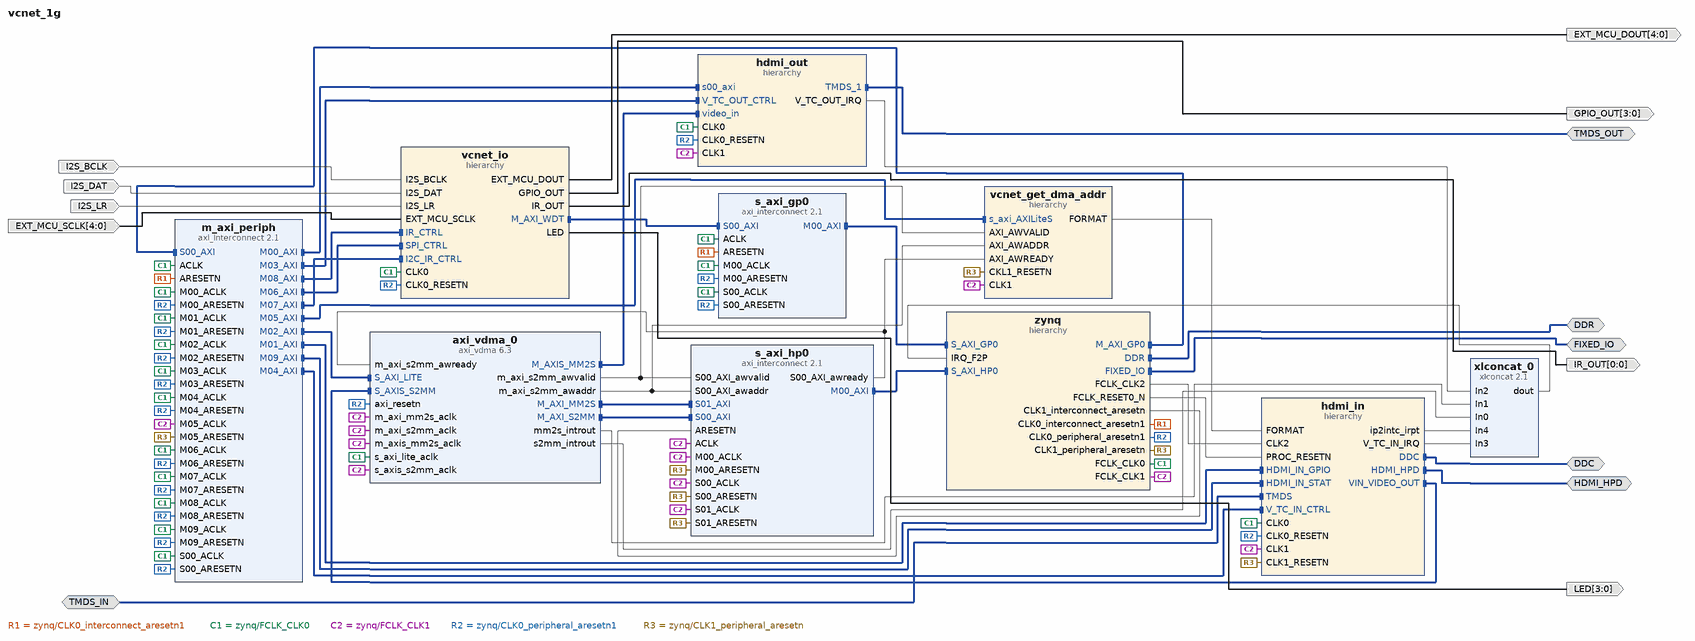
[diagram p0: block diagram of the top level]
# Vivado block design vcnet_1g, xc7z020clg400-1, Vivado 2021.2
create_bd_design vcnet_1g

create_bd_intf_port -mode Master -vlnv xilinx.com:interface:ddrx_rtl:1.0 DDR
create_bd_intf_port -mode Master -vlnv xilinx.com:display_processing_system7:fixedio_rtl:1.0 FIXED_IO
create_bd_intf_port -mode Master -vlnv xilinx.com:interface:gpio_rtl:1.0 HDMI_HPD
create_bd_intf_port -mode Slave -vlnv digilentinc.com:interface:tmds_rtl:1.0 TMDS_IN
create_bd_intf_port -mode Master -vlnv xilinx.com:interface:iic_rtl:1.0 DDC
create_bd_intf_port -mode Master -vlnv digilentinc.com:interface:tmds_rtl:1.0 TMDS_OUT
create_bd_port -dir O -from 0 -to 0 IR_OUT
create_bd_port -dir O -from 3 -to 0 LED
create_bd_port -dir I -from 4 -to 0 EXT_MCU_SCLK
create_bd_port -dir O -from 4 -to 0 EXT_MCU_DOUT
create_bd_port -dir I I2S_BCLK
create_bd_port -dir I I2S_LR
create_bd_port -dir I I2S_DAT
create_bd_port -dir O -from 3 -to 0 GPIO_OUT

create_bd_cell -type ip -vlnv xilinx.com:ip:axi_vdma:6.3 axi_vdma_0
set_property -dict [list \
  CONFIG.c_m_axi_mm2s_data_width 32 \
  CONFIG.c_m_axis_mm2s_tdata_width 24 \
  CONFIG.c_mm2s_genlock_mode 0 \
  CONFIG.c_mm2s_linebuffer_depth 4096 \
  CONFIG.c_mm2s_max_burst_length 32 \
  CONFIG.c_num_fstores 8 \
  CONFIG.c_s2mm_genlock_mode 0 \
  CONFIG.c_s2mm_linebuffer_depth 4096 \
  CONFIG.c_s2mm_max_burst_length 32 \
] [get_bd_cells axi_vdma_0]
create_bd_cell -type hier vcnet_get_dma_addr
create_bd_cell -type hier hdmi_out
create_bd_cell -type hier hdmi_in
create_bd_cell -type hier vcnet_io
create_bd_cell -type hier zynq
create_bd_cell -type ip -vlnv xilinx.com:ip:axi_interconnect:2.1 s_axi_hp0
set_property -dict [list \
  CONFIG.M00_HAS_DATA_FIFO 2 \
  CONFIG.M00_HAS_REGSLICE 4 \
  CONFIG.NUM_MI 1 \
  CONFIG.NUM_SI 2 \
  CONFIG.S00_HAS_DATA_FIFO 2 \
  CONFIG.S00_HAS_REGSLICE 4 \
  CONFIG.S01_HAS_DATA_FIFO 2 \
  CONFIG.S01_HAS_REGSLICE 4 \
] [get_bd_cells s_axi_hp0]
create_bd_cell -type ip -vlnv xilinx.com:ip:axi_interconnect:2.1 m_axi_periph
set_property -dict {CONFIG.NUM_MI 10} [get_bd_cells m_axi_periph]
create_bd_cell -type ip -vlnv xilinx.com:ip:axi_interconnect:2.1 s_axi_gp0
set_property -dict {CONFIG.NUM_MI 1} [get_bd_cells s_axi_gp0]
create_bd_cell -type ip -vlnv xilinx.com:ip:xlconcat:2.1 xlconcat_0
set_property -dict {CONFIG.NUM_PORTS 5 CONFIG.dout_width 5} [get_bd_cells xlconcat_0]

# ---- hierarchy /vcnet_get_dma_addr ----
current_bd_instance /vcnet_get_dma_addr
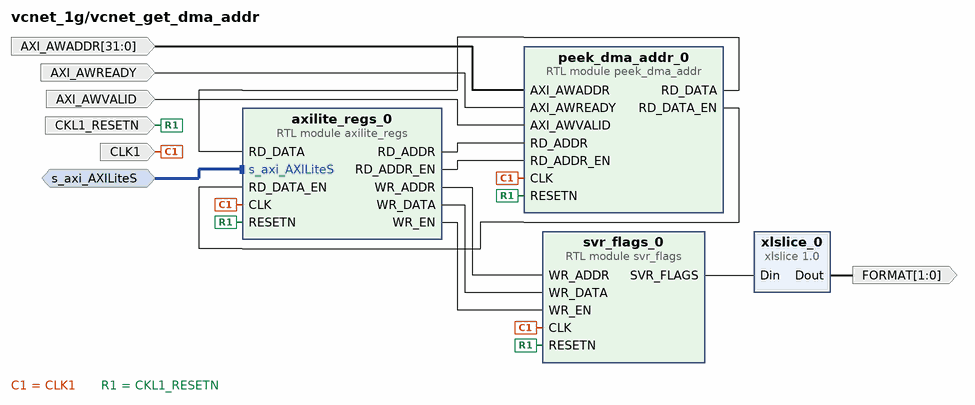
[diagram p1: block diagram inside /vcnet_get_dma_addr]
create_bd_intf_pin -mode Slave -vlnv xilinx.com:interface:aximm_rtl:1.0 s_axi_AXILiteS
create_bd_pin -dir I -type clk CLK1
create_bd_pin -dir I AXI_AWREADY
create_bd_pin -dir I AXI_AWVALID
create_bd_pin -dir I -from 31 -to 0 AXI_AWADDR
create_bd_pin -dir I -type rst CKL1_RESETN
create_bd_pin -dir O -from 1 -to 0 -type data FORMAT

create_bd_cell -type module -reference axilite_regs axilite_regs_0
create_bd_cell -type module -reference svr_flags svr_flags_0
create_bd_cell -type ip -vlnv xilinx.com:ip:xlslice:1.0 xlslice_0
set_property -dict {CONFIG.DIN_FROM 1 CONFIG.DIN_WIDTH 8 CONFIG.DOUT_WIDTH 2} [get_bd_cells xlslice_0]
create_bd_cell -type module -reference peek_dma_addr peek_dma_addr_0

# ---- hierarchy /hdmi_out ----
current_bd_instance /hdmi_out
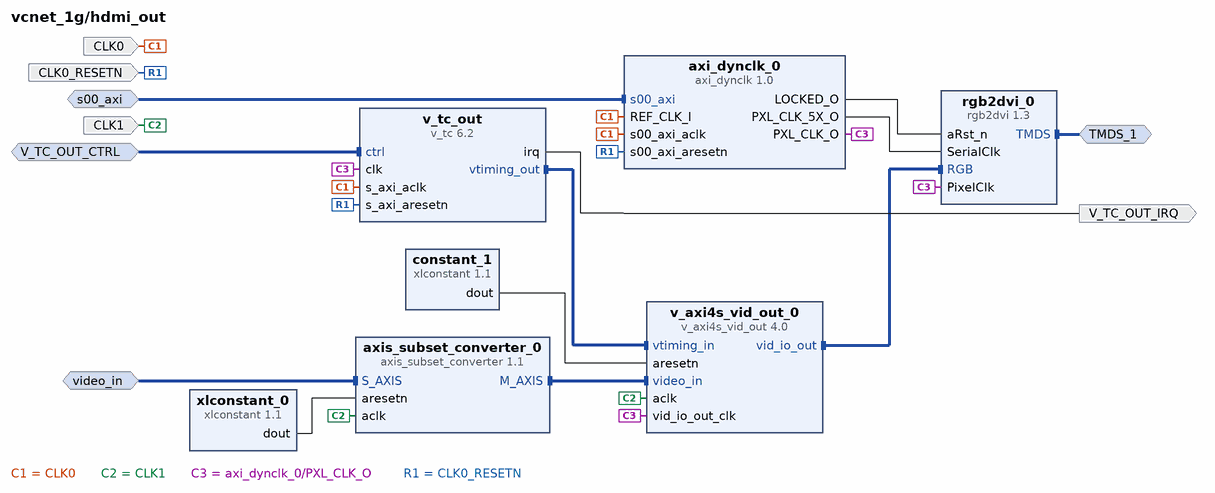
[diagram p2: block diagram inside /hdmi_out]
create_bd_intf_pin -mode Master -vlnv digilentinc.com:interface:tmds_rtl:1.0 TMDS_1
create_bd_intf_pin -mode Slave -vlnv xilinx.com:interface:aximm_rtl:1.0 V_TC_OUT_CTRL
create_bd_intf_pin -mode Slave -vlnv xilinx.com:interface:aximm_rtl:1.0 s00_axi
create_bd_intf_pin -mode Slave -vlnv xilinx.com:interface:axis_rtl:1.0 video_in
create_bd_pin -dir I -type clk CLK0
create_bd_pin -dir I -type clk CLK1
create_bd_pin -dir I -type rst CLK0_RESETN
create_bd_pin -dir O -type intr V_TC_OUT_IRQ

create_bd_cell -type ip -vlnv xilinx.com:ip:v_tc:6.2 v_tc_out
set_property -dict {CONFIG.enable_detection false} [get_bd_cells v_tc_out]
create_bd_cell -type ip -vlnv xilinx.com:ip:xlconstant:1.1 constant_1
create_bd_cell -type ip -vlnv digilentinc.com:ip:axi_dynclk:1.0 axi_dynclk_0
set_property -dict {CONFIG.ADD_BUFMR false} [get_bd_cells axi_dynclk_0]
create_bd_cell -type ip -vlnv xilinx.com:ip:v_axi4s_vid_out:4.0 v_axi4s_vid_out_0
set_property -dict [list \
  CONFIG.C_ADDR_WIDTH 12 \
  CONFIG.C_HAS_ASYNC_CLK 1 \
  CONFIG.C_S_AXIS_VIDEO_DATA_WIDTH 8 \
  CONFIG.C_S_AXIS_VIDEO_FORMAT 2 \
  CONFIG.C_VTG_MASTER_SLAVE 1 \
] [get_bd_cells v_axi4s_vid_out_0]
create_bd_cell -type ip -vlnv digilentinc.com:ip:rgb2dvi:1.3 rgb2dvi_0
set_property -dict {CONFIG.kClkRange 1 CONFIG.kGenerateSerialClk false CONFIG.kRstActiveHigh false} [get_bd_cells rgb2dvi_0]
create_bd_cell -type ip -vlnv xilinx.com:ip:axis_subset_converter:1.1 axis_subset_converter_0
set_property -dict [list \
  CONFIG.M_HAS_TKEEP 1 \
  CONFIG.M_HAS_TLAST 1 \
  CONFIG.M_HAS_TREADY 1 \
  CONFIG.M_HAS_TSTRB 0 \
  CONFIG.M_TDATA_NUM_BYTES 3 \
  CONFIG.M_TDEST_WIDTH 0 \
  CONFIG.M_TID_WIDTH 0 \
  CONFIG.M_TUSER_WIDTH 1 \
  CONFIG.S_HAS_TKEEP 1 \
  CONFIG.S_HAS_TLAST 1 \
  CONFIG.S_HAS_TREADY 1 \
  CONFIG.S_HAS_TSTRB 0 \
  CONFIG.S_TDATA_NUM_BYTES 3 \
  CONFIG.S_TDEST_WIDTH 0 \
  CONFIG.S_TID_WIDTH 0 \
  CONFIG.S_TUSER_WIDTH 1 \
  CONFIG.TDATA_REMAP {tdata[23:16],tdata[7:0],tdata[15:8]} \
  CONFIG.TKEEP_REMAP {tkeep[2:0]} \
  CONFIG.TLAST_REMAP {tlast[0]} \
  CONFIG.TUSER_REMAP {tuser[0:0]} \
] [get_bd_cells axis_subset_converter_0]
create_bd_cell -type ip -vlnv xilinx.com:ip:xlconstant:1.1 xlconstant_0

# ---- hierarchy /hdmi_in ----
current_bd_instance /hdmi_in
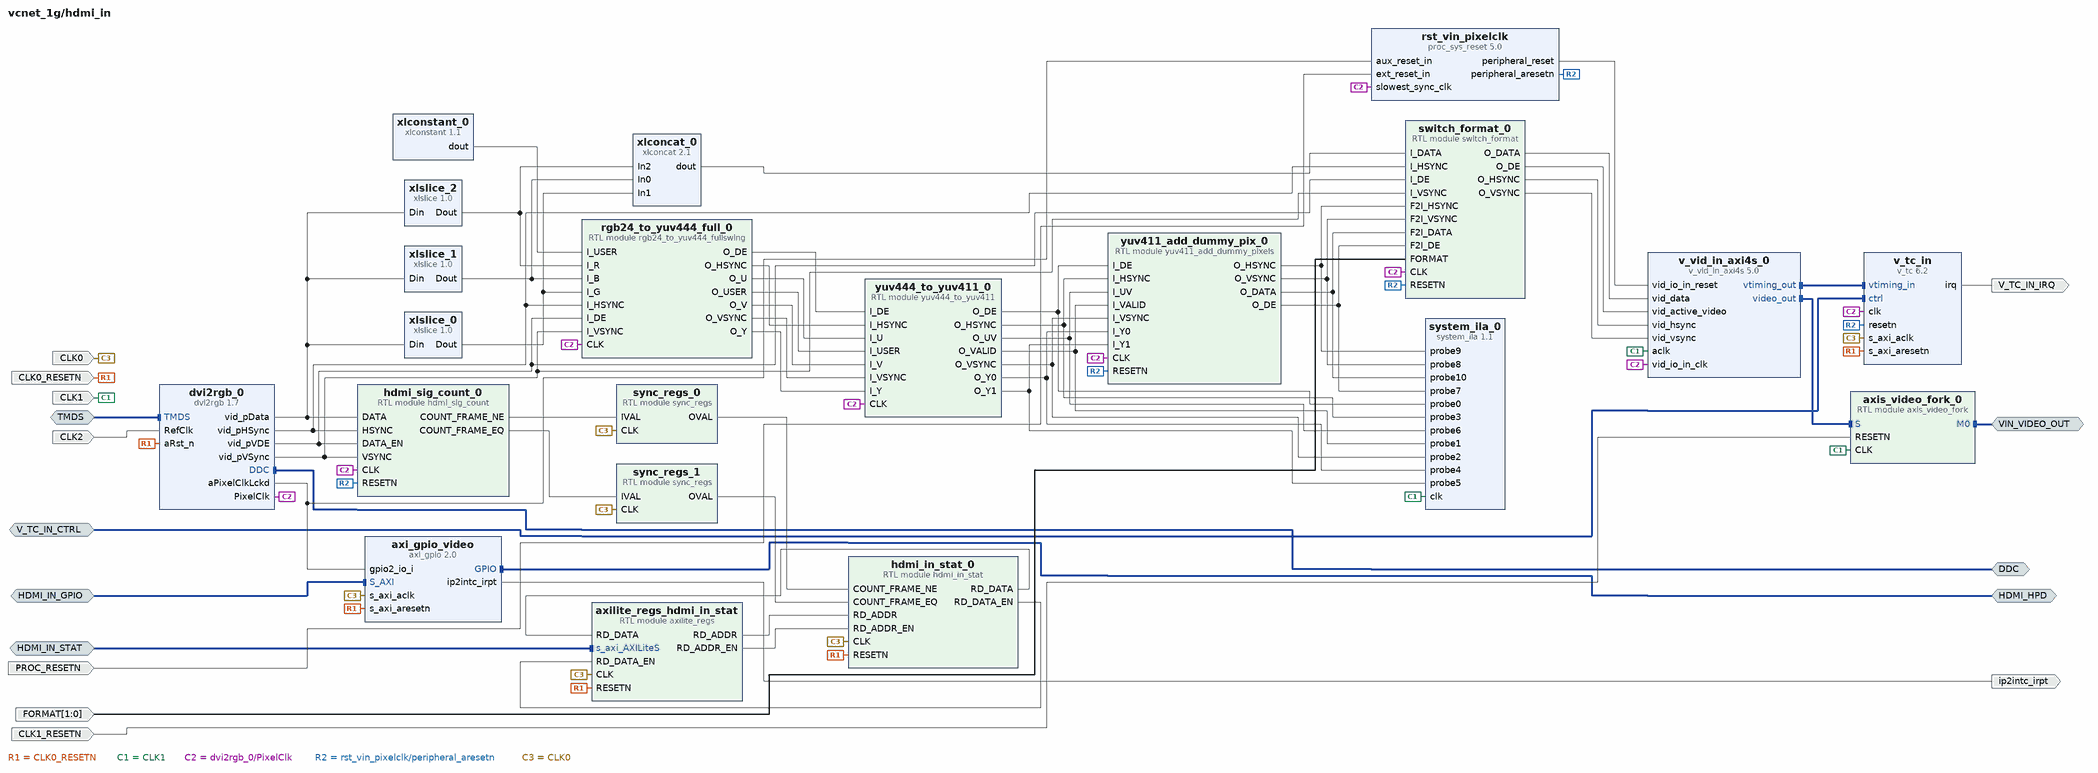
[diagram p3: block diagram inside /hdmi_in]
create_bd_intf_pin -mode Slave -vlnv digilentinc.com:interface:tmds_rtl:1.0 TMDS
create_bd_intf_pin -mode Master -vlnv xilinx.com:interface:iic_rtl:1.0 DDC
create_bd_intf_pin -mode Slave -vlnv xilinx.com:interface:aximm_rtl:1.0 V_TC_IN_CTRL
create_bd_intf_pin -mode Master -vlnv xilinx.com:interface:axis_rtl:1.0 VIN_VIDEO_OUT
create_bd_intf_pin -mode Master -vlnv xilinx.com:interface:gpio_rtl:1.0 HDMI_HPD
create_bd_intf_pin -mode Slave -vlnv xilinx.com:interface:aximm_rtl:1.0 HDMI_IN_GPIO
create_bd_intf_pin -mode Slave -vlnv xilinx.com:interface:aximm_rtl:1.0 HDMI_IN_STAT
create_bd_pin -dir I -type clk CLK2
create_bd_pin -dir I -type clk CLK0
create_bd_pin -dir I -type clk CLK1
create_bd_pin -dir I -type rst CLK0_RESETN
create_bd_pin -dir I -type rst CLK1_RESETN
create_bd_pin -dir O -type intr V_TC_IN_IRQ
create_bd_pin -dir I -type rst PROC_RESETN
create_bd_pin -dir I -from 1 -to 0 -type data FORMAT
create_bd_pin -dir O -type intr ip2intc_irpt

create_bd_cell -type ip -vlnv xilinx.com:ip:v_tc:6.2 v_tc_in
set_property -dict [list \
  CONFIG.HAS_INTC_IF true \
  CONFIG.enable_generation false \
  CONFIG.horizontal_blank_detection false \
  CONFIG.max_lines_per_frame 2048 \
  CONFIG.vertical_blank_detection false \
] [get_bd_cells v_tc_in]
create_bd_cell -type module -reference axis_video_fork axis_video_fork_0
create_bd_cell -type ip -vlnv xilinx.com:ip:v_vid_in_axi4s:5.0 v_vid_in_axi4s_0
set_property -dict {CONFIG.C_ADDR_WIDTH 12 CONFIG.C_HAS_ASYNC_CLK 1} [get_bd_cells v_vid_in_axi4s_0]
create_bd_cell -type ip -vlnv digilentinc.com:ip:dvi2rgb:1.7 dvi2rgb_0
set_property -dict [list \
  CONFIG.kAddBUFG false \
  CONFIG.kClkRange 1 \
  CONFIG.kEdidFileName 1080_edid.data \
  CONFIG.kRstActiveHigh false \
] [get_bd_cells dvi2rgb_0]
create_bd_cell -type ip -vlnv xilinx.com:ip:proc_sys_reset:5.0 rst_vin_pixelclk
create_bd_cell -type ip -vlnv xilinx.com:ip:axi_gpio:2.0 axi_gpio_video
set_property -dict [list \
  CONFIG.C_ALL_INPUTS_2 1 \
  CONFIG.C_ALL_OUTPUTS 1 \
  CONFIG.C_GPIO2_WIDTH 1 \
  CONFIG.C_GPIO_WIDTH 1 \
  CONFIG.C_INTERRUPT_PRESENT 1 \
  CONFIG.C_IS_DUAL 1 \
] [get_bd_cells axi_gpio_video]
create_bd_cell -type ip -vlnv xilinx.com:ip:xlslice:1.0 xlslice_0
set_property -dict {CONFIG.DIN_FROM 7 CONFIG.DIN_WIDTH 24 CONFIG.DOUT_WIDTH 8} [get_bd_cells xlslice_0]
create_bd_cell -type ip -vlnv xilinx.com:ip:xlslice:1.0 xlslice_1
set_property -dict {CONFIG.DIN_FROM 15 CONFIG.DIN_TO 8 CONFIG.DIN_WIDTH 24 CONFIG.DOUT_WIDTH 8} [get_bd_cells xlslice_1]
create_bd_cell -type ip -vlnv xilinx.com:ip:xlslice:1.0 xlslice_2
set_property -dict {CONFIG.DIN_FROM 23 CONFIG.DIN_TO 16 CONFIG.DIN_WIDTH 24 CONFIG.DOUT_WIDTH 8} [get_bd_cells xlslice_2]
create_bd_cell -type ip -vlnv xilinx.com:ip:xlconstant:1.1 xlconstant_0
set_property -dict {CONFIG.CONST_VAL 0} [get_bd_cells xlconstant_0]
create_bd_cell -type module -reference switch_format switch_format_0
create_bd_cell -type ip -vlnv xilinx.com:ip:xlconcat:2.1 xlconcat_0
set_property -dict {CONFIG.IN0_WIDTH 8 CONFIG.IN1_WIDTH 8 CONFIG.IN2_WIDTH 8 CONFIG.NUM_PORTS 3} [get_bd_cells xlconcat_0]
create_bd_cell -type ip -vlnv xilinx.com:ip:system_ila:1.1 system_ila_0
set_property -dict {CONFIG.C_DATA_DEPTH 8192 CONFIG.C_MON_TYPE NATIVE CONFIG.C_NUM_OF_PROBES 11} [get_bd_cells system_ila_0]
create_bd_cell -type module -reference yuv444_to_yuv411 yuv444_to_yuv411_0
create_bd_cell -type module -reference yuv411_add_dummy_pixels yuv411_add_dummy_pix_0
create_bd_cell -type module -reference hdmi_sig_count hdmi_sig_count_0
create_bd_cell -type module -reference axilite_regs axilite_regs_hdmi_in_stat
create_bd_cell -type module -reference sync_regs sync_regs_0
set_property -dict {CONFIG.WIDTH 32} [get_bd_cells sync_regs_0]
create_bd_cell -type module -reference sync_regs sync_regs_1
set_property -dict {CONFIG.WIDTH 32} [get_bd_cells sync_regs_1]
create_bd_cell -type module -reference hdmi_in_stat hdmi_in_stat_0
create_bd_cell -type module -reference rgb24_to_yuv444_fullswing rgb24_to_yuv444_full_0

# ---- hierarchy /vcnet_io ----
current_bd_instance /vcnet_io
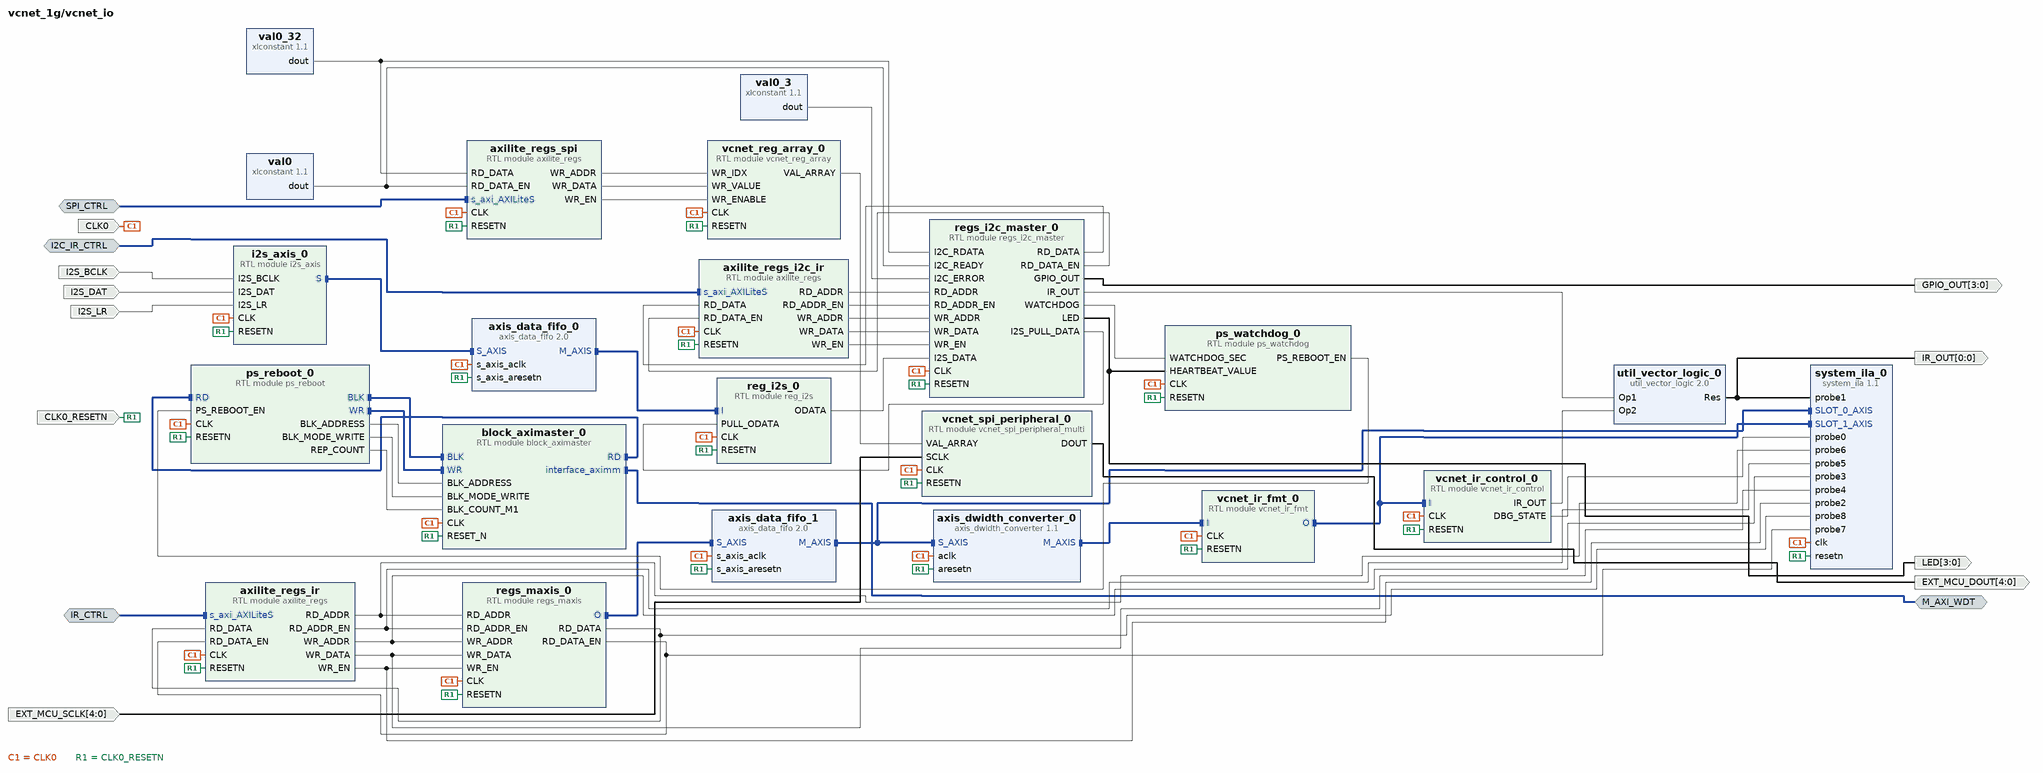
[diagram p4: block diagram inside /vcnet_io]
create_bd_intf_pin -mode Slave -vlnv xilinx.com:interface:aximm_rtl:1.0 SPI_CTRL
create_bd_intf_pin -mode Slave -vlnv xilinx.com:interface:aximm_rtl:1.0 I2C_IR_CTRL
create_bd_intf_pin -mode Master -vlnv xilinx.com:interface:aximm_rtl:1.0 M_AXI_WDT
create_bd_intf_pin -mode Slave -vlnv xilinx.com:interface:aximm_rtl:1.0 IR_CTRL
create_bd_pin -dir I -type clk CLK0
create_bd_pin -dir I -type rst CLK0_RESETN
create_bd_pin -dir O -from 0 -to 0 IR_OUT
create_bd_pin -dir O -from 3 -to 0 LED
create_bd_pin -dir I -from 4 -to 0 EXT_MCU_SCLK
create_bd_pin -dir O -from 4 -to 0 EXT_MCU_DOUT
create_bd_pin -dir I I2S_BCLK
create_bd_pin -dir I I2S_LR
create_bd_pin -dir I I2S_DAT
create_bd_pin -dir O -from 3 -to 0 GPIO_OUT

create_bd_cell -type module -reference axilite_regs axilite_regs_i2c_ir
create_bd_cell -type module -reference axilite_regs axilite_regs_spi
create_bd_cell -type ip -vlnv xilinx.com:ip:xlconstant:1.1 val0
set_property -dict {CONFIG.CONST_VAL 0 CONFIG.CONST_WIDTH 1} [get_bd_cells val0]
create_bd_cell -type ip -vlnv xilinx.com:ip:xlconstant:1.1 val0_32
set_property -dict {CONFIG.CONST_VAL 0 CONFIG.CONST_WIDTH 32} [get_bd_cells val0_32]
create_bd_cell -type ip -vlnv xilinx.com:ip:xlconstant:1.1 val0_3
set_property -dict {CONFIG.CONST_WIDTH 3} [get_bd_cells val0_3]
create_bd_cell -type module -reference ps_watchdog ps_watchdog_0
create_bd_cell -type module -reference block_aximaster block_aximaster_0
create_bd_cell -type module -reference ps_reboot ps_reboot_0
create_bd_cell -type module -reference i2s_axis i2s_axis_0
create_bd_cell -type ip -vlnv xilinx.com:ip:axis_data_fifo:2.0 axis_data_fifo_0
create_bd_cell -type module -reference reg_i2s reg_i2s_0
create_bd_cell -type module -reference vcnet_reg_array vcnet_reg_array_0
create_bd_cell -type module -reference vcnet_spi_peripheral_multi vcnet_spi_peripheral_0
create_bd_cell -type module -reference axilite_regs axilite_regs_ir
create_bd_cell -type module -reference vcnet_ir_control vcnet_ir_control_0
create_bd_cell -type ip -vlnv xilinx.com:ip:axis_dwidth_converter:1.1 axis_dwidth_converter_0
set_property -dict [list \
  CONFIG.HAS_TKEEP 0 \
  CONFIG.HAS_TLAST 0 \
  CONFIG.HAS_TSTRB 0 \
  CONFIG.M_TDATA_NUM_BYTES 2 \
  CONFIG.S_TDATA_NUM_BYTES 4 \
  CONFIG.TDEST_WIDTH 0 \
  CONFIG.TID_WIDTH 0 \
  CONFIG.TUSER_BITS_PER_BYTE 0 \
] [get_bd_cells axis_dwidth_converter_0]
create_bd_cell -type ip -vlnv xilinx.com:ip:system_ila:1.1 system_ila_0
set_property -dict [list \
  CONFIG.C_MON_TYPE MIX \
  CONFIG.C_NUM_MONITOR_SLOTS 2 \
  CONFIG.C_NUM_OF_PROBES 9 \
  CONFIG.C_SLOT 1 \
  CONFIG.C_SLOT_0_INTF_TYPE xilinx.com:interface:axis_rtl:1.0 \
  CONFIG.C_SLOT_1_INTF_TYPE xilinx.com:interface:axis_rtl:1.0 \
] [get_bd_cells system_ila_0]
create_bd_cell -type ip -vlnv xilinx.com:ip:util_vector_logic:2.0 util_vector_logic_0
set_property -dict {CONFIG.C_SIZE 1} [get_bd_cells util_vector_logic_0]
create_bd_cell -type module -reference regs_i2c_master regs_i2c_master_0
create_bd_cell -type ip -vlnv xilinx.com:ip:axis_data_fifo:2.0 axis_data_fifo_1
set_property -dict [list \
  CONFIG.HAS_TKEEP 0 \
  CONFIG.HAS_TLAST 0 \
  CONFIG.HAS_TSTRB 0 \
  CONFIG.TDATA_NUM_BYTES 4 \
  CONFIG.TDEST_WIDTH 0 \
  CONFIG.TID_WIDTH 0 \
  CONFIG.TUSER_WIDTH 0 \
] [get_bd_cells axis_data_fifo_1]
create_bd_cell -type module -reference regs_maxis regs_maxis_0
create_bd_cell -type module -reference vcnet_ir_fmt vcnet_ir_fmt_0

# ---- hierarchy /zynq ----
current_bd_instance /zynq
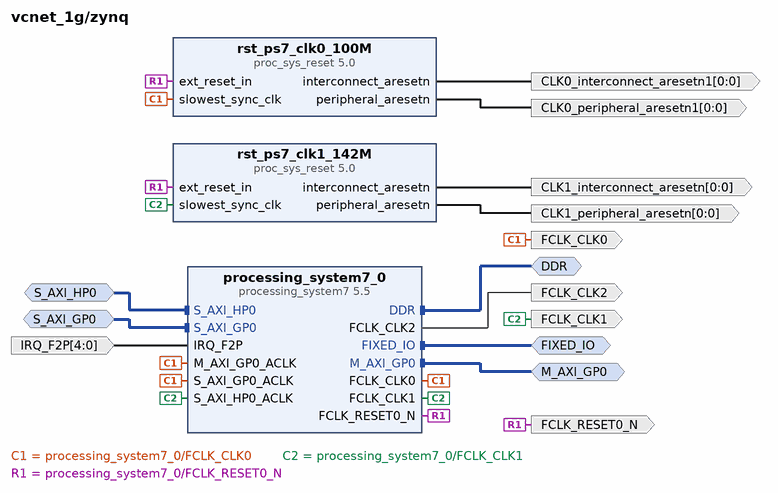
[diagram p5: block diagram inside /zynq]
create_bd_intf_pin -mode Master -vlnv xilinx.com:display_processing_system7:fixedio_rtl:1.0 FIXED_IO
create_bd_intf_pin -mode Master -vlnv xilinx.com:interface:ddrx_rtl:1.0 DDR
create_bd_intf_pin -mode Slave -vlnv xilinx.com:interface:aximm_rtl:1.0 S_AXI_HP0
create_bd_intf_pin -mode Master -vlnv xilinx.com:interface:aximm_rtl:1.0 M_AXI_GP0
create_bd_intf_pin -mode Slave -vlnv xilinx.com:interface:aximm_rtl:1.0 S_AXI_GP0
create_bd_pin -dir I -from 4 -to 0 -type intr IRQ_F2P
create_bd_pin -dir O -from 0 -to 0 -type rst CLK1_peripheral_aresetn
create_bd_pin -dir O -type clk FCLK_CLK0
create_bd_pin -dir O -from 0 -to 0 -type rst CLK1_interconnect_aresetn
create_bd_pin -dir O -from 0 -to 0 -type rst CLK0_peripheral_aresetn1
create_bd_pin -dir O -type clk FCLK_CLK1
create_bd_pin -dir O -from 0 -to 0 -type rst CLK0_interconnect_aresetn1
create_bd_pin -dir O -type rst FCLK_RESET0_N
create_bd_pin -dir O -type clk FCLK_CLK2

create_bd_cell -type ip -vlnv xilinx.com:ip:proc_sys_reset:5.0 rst_ps7_clk0_100M
create_bd_cell -type ip -vlnv xilinx.com:ip:proc_sys_reset:5.0 rst_ps7_clk1_142M
create_bd_cell -type ip -vlnv xilinx.com:ip:processing_system7:5.5 processing_system7_0
set_property -dict [list \
  CONFIG.PCW_APU_PERIPHERAL_FREQMHZ 650 \
  CONFIG.PCW_CRYSTAL_PERIPHERAL_FREQMHZ 50.000 \
  CONFIG.PCW_ENET0_ENET0_IO {MIO 16 .. 27} \
  CONFIG.PCW_ENET0_GRP_MDIO_ENABLE 1 \
  CONFIG.PCW_ENET0_GRP_MDIO_IO {MIO 52 .. 53} \
  CONFIG.PCW_ENET0_PERIPHERAL_ENABLE 1 \
  CONFIG.PCW_ENET0_RESET_ENABLE 1 \
  CONFIG.PCW_ENET0_RESET_IO {MIO 9} \
  CONFIG.PCW_ENET_RESET_ENABLE 1 \
  CONFIG.PCW_ENET_RESET_SELECT {Share reset pin} \
  CONFIG.PCW_EN_CLK1_PORT 1 \
  CONFIG.PCW_EN_CLK2_PORT 1 \
  CONFIG.PCW_FCLK_CLK1_BUF TRUE \
  CONFIG.PCW_FCLK_CLK2_BUF TRUE \
  CONFIG.PCW_FPGA0_PERIPHERAL_FREQMHZ 100 \
  CONFIG.PCW_FPGA1_PERIPHERAL_FREQMHZ 140 \
  CONFIG.PCW_FPGA2_PERIPHERAL_FREQMHZ 200 \
  CONFIG.PCW_FPGA_FCLK1_ENABLE 1 \
  CONFIG.PCW_FPGA_FCLK2_ENABLE 1 \
  CONFIG.PCW_GPIO_MIO_GPIO_ENABLE 1 \
  CONFIG.PCW_GPIO_MIO_GPIO_IO MIO \
  CONFIG.PCW_I2C0_I2C0_IO EMIO \
  CONFIG.PCW_I2C0_PERIPHERAL_ENABLE 1 \
  CONFIG.PCW_I2C1_I2C1_IO EMIO \
  CONFIG.PCW_I2C1_PERIPHERAL_ENABLE 1 \
  CONFIG.PCW_I2C_PERIPHERAL_FREQMHZ 108.333336 \
  CONFIG.PCW_I2C_RESET_ENABLE 1 \
  CONFIG.PCW_I2C_RESET_SELECT {Share reset pin} \
  CONFIG.PCW_IRQ_F2P_INTR 1 \
  CONFIG.PCW_PRESET_BANK1_VOLTAGE {LVCMOS 1.8V} \
  CONFIG.PCW_QSPI_GRP_FBCLK_ENABLE 1 \
  CONFIG.PCW_QSPI_GRP_FBCLK_IO {MIO 8} \
  CONFIG.PCW_QSPI_GRP_SINGLE_SS_ENABLE 1 \
  CONFIG.PCW_QSPI_GRP_SINGLE_SS_IO {MIO 1 .. 6} \
  CONFIG.PCW_QSPI_PERIPHERAL_ENABLE 1 \
  CONFIG.PCW_QSPI_QSPI_IO {MIO 1 .. 6} \
  CONFIG.PCW_SD0_GRP_CD_ENABLE 1 \
  CONFIG.PCW_SD0_GRP_CD_IO {MIO 47} \
  CONFIG.PCW_SD0_GRP_WP_ENABLE 1 \
  CONFIG.PCW_SD0_GRP_WP_IO EMIO \
  CONFIG.PCW_SD0_PERIPHERAL_ENABLE 1 \
  CONFIG.PCW_SD0_SD0_IO {MIO 40 .. 45} \
  CONFIG.PCW_SDIO_PERIPHERAL_FREQMHZ 50 \
  CONFIG.PCW_SINGLE_QSPI_DATA_MODE x4 \
  CONFIG.PCW_UART0_PERIPHERAL_ENABLE 1 \
  CONFIG.PCW_UART0_UART0_IO {MIO 14 .. 15} \
  CONFIG.PCW_UART1_PERIPHERAL_ENABLE 0 \
  CONFIG.PCW_UART_PERIPHERAL_FREQMHZ 100 \
  CONFIG.PCW_UIPARAM_DDR_BUS_WIDTH {16 Bit} \
  CONFIG.PCW_UIPARAM_DDR_FREQ_MHZ 525 \
  CONFIG.PCW_UIPARAM_DDR_PARTNO {MT41K256M16 RE-125} \
  CONFIG.PCW_USB0_PERIPHERAL_ENABLE 1 \
  CONFIG.PCW_USB0_RESET_ENABLE 1 \
  CONFIG.PCW_USB0_RESET_IO {MIO 46} \
  CONFIG.PCW_USB0_USB0_IO {MIO 28 .. 39} \
  CONFIG.PCW_USB_RESET_ENABLE 1 \
  CONFIG.PCW_USB_RESET_SELECT {Share reset pin} \
  CONFIG.PCW_USE_FABRIC_INTERRUPT 1 \
  CONFIG.PCW_USE_S_AXI_GP0 1 \
  CONFIG.PCW_USE_S_AXI_HP0 1 \
] [get_bd_cells processing_system7_0]
# 219 more settings of processing_system7_0 are not shown: defaults, MIO pin electricals, DDR timing, and values the tool derives

# ---- connections ----

current_bd_instance /vcnet_get_dma_addr
connect_bd_intf_net [get_bd_intf_pins s_axi_AXILiteS] [get_bd_intf_pins axilite_regs_0/s_axi_AXILiteS]
connect_bd_net [get_bd_pins AXI_AWADDR] [get_bd_pins peek_dma_addr_0/AXI_AWADDR]
connect_bd_net [get_bd_pins AXI_AWREADY] [get_bd_pins peek_dma_addr_0/AXI_AWREADY]
connect_bd_net [get_bd_pins AXI_AWVALID] [get_bd_pins peek_dma_addr_0/AXI_AWVALID]
connect_bd_net [get_bd_pins CLK1] [get_bd_pins svr_flags_0/CLK] [get_bd_pins axilite_regs_0/CLK] [get_bd_pins peek_dma_addr_0/CLK]
connect_bd_net -net RESETN_1 [get_bd_pins CKL1_RESETN] \
  [get_bd_pins svr_flags_0/RESETN] [get_bd_pins axilite_regs_0/RESETN] [get_bd_pins peek_dma_addr_0/RESETN]
connect_bd_net [get_bd_pins axilite_regs_0/RD_ADDR] [get_bd_pins peek_dma_addr_0/RD_ADDR]
connect_bd_net [get_bd_pins axilite_regs_0/RD_ADDR_EN] [get_bd_pins peek_dma_addr_0/RD_ADDR_EN]
connect_bd_net [get_bd_pins axilite_regs_0/WR_ADDR] [get_bd_pins svr_flags_0/WR_ADDR]
connect_bd_net [get_bd_pins axilite_regs_0/WR_DATA] [get_bd_pins svr_flags_0/WR_DATA]
connect_bd_net [get_bd_pins axilite_regs_0/WR_EN] [get_bd_pins svr_flags_0/WR_EN]
connect_bd_net [get_bd_pins peek_dma_addr_0/RD_DATA] [get_bd_pins axilite_regs_0/RD_DATA]
connect_bd_net [get_bd_pins peek_dma_addr_0/RD_DATA_EN] [get_bd_pins axilite_regs_0/RD_DATA_EN]
connect_bd_net [get_bd_pins svr_flags_0/SVR_FLAGS] [get_bd_pins xlslice_0/Din]
connect_bd_net [get_bd_pins xlslice_0/Dout] [get_bd_pins FORMAT]

current_bd_instance /hdmi_out
connect_bd_intf_net [get_bd_intf_pins TMDS_1] [get_bd_intf_pins rgb2dvi_0/TMDS]
connect_bd_intf_net [get_bd_intf_pins V_TC_OUT_CTRL] [get_bd_intf_pins v_tc_out/ctrl]
connect_bd_intf_net [get_bd_intf_pins s00_axi] [get_bd_intf_pins axi_dynclk_0/s00_axi]
connect_bd_intf_net [get_bd_intf_pins axis_subset_converter_0/M_AXIS] [get_bd_intf_pins v_axi4s_vid_out_0/video_in]
connect_bd_intf_net [get_bd_intf_pins v_axi4s_vid_out_0/vid_io_out] [get_bd_intf_pins rgb2dvi_0/RGB]
connect_bd_intf_net -intf_net v_tc_0_vtiming_out [get_bd_intf_pins v_tc_out/vtiming_out] [get_bd_intf_pins v_axi4s_vid_out_0/vtiming_in]
connect_bd_intf_net [get_bd_intf_pins video_in] [get_bd_intf_pins axis_subset_converter_0/S_AXIS]
connect_bd_net -net REF_CLK_I_1 [get_bd_pins CLK0] \
  [get_bd_pins axi_dynclk_0/REF_CLK_I] [get_bd_pins axi_dynclk_0/s00_axi_aclk] [get_bd_pins v_tc_out/s_axi_aclk]
connect_bd_net -net aclk_1 [get_bd_pins CLK1] [get_bd_pins v_axi4s_vid_out_0/aclk] [get_bd_pins axis_subset_converter_0/aclk]
connect_bd_net [get_bd_pins axi_dynclk_0/LOCKED_O] [get_bd_pins rgb2dvi_0/aRst_n]
connect_bd_net [get_bd_pins axi_dynclk_0/PXL_CLK_5X_O] [get_bd_pins rgb2dvi_0/SerialClk]
connect_bd_net [get_bd_pins axi_dynclk_0/PXL_CLK_O] \
  [get_bd_pins rgb2dvi_0/PixelClk] [get_bd_pins v_axi4s_vid_out_0/vid_io_out_clk] [get_bd_pins v_tc_out/clk]
connect_bd_net [get_bd_pins constant_1/dout] [get_bd_pins v_axi4s_vid_out_0/aresetn]
connect_bd_net -net s00_axi_aresetn_1 [get_bd_pins CLK0_RESETN] [get_bd_pins axi_dynclk_0/s00_axi_aresetn] [get_bd_pins v_tc_out/s_axi_aresetn]
connect_bd_net [get_bd_pins v_tc_out/irq] [get_bd_pins V_TC_OUT_IRQ]
connect_bd_net [get_bd_pins xlconstant_0/dout] [get_bd_pins axis_subset_converter_0/aresetn]

current_bd_instance /hdmi_in
connect_bd_intf_net [get_bd_intf_pins TMDS] [get_bd_intf_pins dvi2rgb_0/TMDS]
connect_bd_intf_net [get_bd_intf_pins DDC] [get_bd_intf_pins dvi2rgb_0/DDC]
connect_bd_intf_net [get_bd_intf_pins V_TC_IN_CTRL] [get_bd_intf_pins v_tc_in/ctrl]
connect_bd_intf_net [get_bd_intf_pins HDMI_HPD] [get_bd_intf_pins axi_gpio_video/GPIO]
connect_bd_intf_net [get_bd_intf_pins HDMI_IN_GPIO] [get_bd_intf_pins axi_gpio_video/S_AXI]
connect_bd_intf_net [get_bd_intf_pins HDMI_IN_STAT] [get_bd_intf_pins axilite_regs_hdmi_in_stat/s_axi_AXILiteS]
connect_bd_intf_net [get_bd_intf_pins VIN_VIDEO_OUT] [get_bd_intf_pins axis_video_fork_0/M0]
connect_bd_intf_net [get_bd_intf_pins v_vid_in_axi4s_0/video_out] [get_bd_intf_pins axis_video_fork_0/S]
connect_bd_intf_net [get_bd_intf_pins v_vid_in_axi4s_0/vtiming_out] [get_bd_intf_pins v_tc_in/vtiming_in]
connect_bd_net [get_bd_pins FORMAT] [get_bd_pins switch_format_0/FORMAT]
connect_bd_net -net RESETN_1 [get_bd_pins CLK1_RESETN] [get_bd_pins axis_video_fork_0/RESETN]
connect_bd_net -net RefClk_1 [get_bd_pins CLK2] [get_bd_pins dvi2rgb_0/RefClk]
connect_bd_net -net aRst_n_1 [get_bd_pins CLK0_RESETN] \
  [get_bd_pins dvi2rgb_0/aRst_n] [get_bd_pins v_tc_in/s_axi_aresetn] [get_bd_pins axi_gpio_video/s_axi_aresetn] \
  [get_bd_pins axilite_regs_hdmi_in_stat/RESETN] [get_bd_pins hdmi_in_stat_0/RESETN]
connect_bd_net -net aclk_1 [get_bd_pins CLK1] [get_bd_pins v_vid_in_axi4s_0/aclk] [get_bd_pins axis_video_fork_0/CLK] [get_bd_pins system_ila_0/clk]
connect_bd_net -net add_dummy_pixels_0_O_HSYNC [get_bd_pins yuv411_add_dummy_pix_0/O_HSYNC] \
  [get_bd_pins switch_format_0/F2I_HSYNC] [get_bd_pins system_ila_0/probe9]
connect_bd_net -net add_dummy_pixels_0_O_VSYNC [get_bd_pins yuv411_add_dummy_pix_0/O_VSYNC] \
  [get_bd_pins switch_format_0/F2I_VSYNC] [get_bd_pins system_ila_0/probe8]
connect_bd_net [get_bd_pins axi_gpio_video/ip2intc_irpt] [get_bd_pins ip2intc_irpt]
connect_bd_net -net axilite_regs_0_RD_ADDR [get_bd_pins axilite_regs_hdmi_in_stat/RD_ADDR] [get_bd_pins hdmi_in_stat_0/RD_ADDR]
connect_bd_net -net axilite_regs_0_RD_ADDR_EN [get_bd_pins axilite_regs_hdmi_in_stat/RD_ADDR_EN] [get_bd_pins hdmi_in_stat_0/RD_ADDR_EN]
connect_bd_net [get_bd_pins dvi2rgb_0/PixelClk] \
  [get_bd_pins v_vid_in_axi4s_0/vid_io_in_clk] [get_bd_pins v_tc_in/clk] [get_bd_pins rst_vin_pixelclk/slowest_sync_clk] \
  [get_bd_pins switch_format_0/CLK] [get_bd_pins yuv444_to_yuv411_0/CLK] [get_bd_pins yuv411_add_dummy_pix_0/CLK] \
  [get_bd_pins hdmi_sig_count_0/CLK] [get_bd_pins rgb24_to_yuv444_full_0/CLK]
connect_bd_net [get_bd_pins dvi2rgb_0/aPixelClkLckd] [get_bd_pins rst_vin_pixelclk/aux_reset_in] [get_bd_pins axi_gpio_video/gpio2_io_i]
connect_bd_net [get_bd_pins dvi2rgb_0/vid_pData] \
  [get_bd_pins xlslice_2/Din] [get_bd_pins xlslice_0/Din] [get_bd_pins xlslice_1/Din] [get_bd_pins hdmi_sig_count_0/DATA]
connect_bd_net [get_bd_pins dvi2rgb_0/vid_pHSync] \
  [get_bd_pins switch_format_0/I_HSYNC] [get_bd_pins hdmi_sig_count_0/HSYNC] [get_bd_pins rgb24_to_yuv444_full_0/I_HSYNC]
connect_bd_net [get_bd_pins dvi2rgb_0/vid_pVDE] \
  [get_bd_pins switch_format_0/I_DE] [get_bd_pins hdmi_sig_count_0/DATA_EN] [get_bd_pins rgb24_to_yuv444_full_0/I_DE]
connect_bd_net [get_bd_pins dvi2rgb_0/vid_pVSync] \
  [get_bd_pins switch_format_0/I_VSYNC] [get_bd_pins hdmi_sig_count_0/VSYNC] [get_bd_pins rgb24_to_yuv444_full_0/I_VSYNC]
connect_bd_net -net ext_reset_in_1 [get_bd_pins PROC_RESETN] [get_bd_pins rst_vin_pixelclk/ext_reset_in]
connect_bd_net [get_bd_pins hdmi_in_stat_0/RD_DATA] [get_bd_pins axilite_regs_hdmi_in_stat/RD_DATA]
connect_bd_net [get_bd_pins hdmi_in_stat_0/RD_DATA_EN] [get_bd_pins axilite_regs_hdmi_in_stat/RD_DATA_EN]
connect_bd_net [get_bd_pins hdmi_sig_count_0/COUNT_FRAME_EQ] [get_bd_pins sync_regs_1/IVAL]
connect_bd_net [get_bd_pins hdmi_sig_count_0/COUNT_FRAME_NE] [get_bd_pins sync_regs_0/IVAL]
connect_bd_net [get_bd_pins rgb24_to_yuv444_full_0/O_DE] [get_bd_pins yuv444_to_yuv411_0/I_DE]
connect_bd_net [get_bd_pins rgb24_to_yuv444_full_0/O_HSYNC] [get_bd_pins yuv444_to_yuv411_0/I_HSYNC]
connect_bd_net [get_bd_pins rgb24_to_yuv444_full_0/O_U] [get_bd_pins yuv444_to_yuv411_0/I_U]
connect_bd_net [get_bd_pins rgb24_to_yuv444_full_0/O_USER] [get_bd_pins yuv444_to_yuv411_0/I_USER]
connect_bd_net [get_bd_pins rgb24_to_yuv444_full_0/O_V] [get_bd_pins yuv444_to_yuv411_0/I_V]
connect_bd_net [get_bd_pins rgb24_to_yuv444_full_0/O_VSYNC] [get_bd_pins yuv444_to_yuv411_0/I_VSYNC]
connect_bd_net [get_bd_pins rgb24_to_yuv444_full_0/O_Y] [get_bd_pins yuv444_to_yuv411_0/I_Y]
connect_bd_net [get_bd_pins rst_vin_pixelclk/peripheral_aresetn] \
  [get_bd_pins v_tc_in/resetn] [get_bd_pins switch_format_0/RESETN] [get_bd_pins yuv411_add_dummy_pix_0/RESETN] \
  [get_bd_pins hdmi_sig_count_0/RESETN]
connect_bd_net [get_bd_pins rst_vin_pixelclk/peripheral_reset] [get_bd_pins v_vid_in_axi4s_0/vid_io_in_reset]
connect_bd_net -net s_axi_aclk_1 [get_bd_pins CLK0] \
  [get_bd_pins v_tc_in/s_axi_aclk] [get_bd_pins axi_gpio_video/s_axi_aclk] [get_bd_pins sync_regs_1/CLK] \
  [get_bd_pins sync_regs_0/CLK] [get_bd_pins axilite_regs_hdmi_in_stat/CLK] [get_bd_pins hdmi_in_stat_0/CLK]
connect_bd_net [get_bd_pins switch_format_0/O_DATA] [get_bd_pins v_vid_in_axi4s_0/vid_data]
connect_bd_net [get_bd_pins switch_format_0/O_DE] [get_bd_pins v_vid_in_axi4s_0/vid_active_video]
connect_bd_net [get_bd_pins switch_format_0/O_HSYNC] [get_bd_pins v_vid_in_axi4s_0/vid_hsync]
connect_bd_net [get_bd_pins switch_format_0/O_VSYNC] [get_bd_pins v_vid_in_axi4s_0/vid_vsync]
connect_bd_net [get_bd_pins sync_regs_0/OVAL] [get_bd_pins hdmi_in_stat_0/COUNT_FRAME_NE]
connect_bd_net [get_bd_pins sync_regs_1/OVAL] [get_bd_pins hdmi_in_stat_0/COUNT_FRAME_EQ]
connect_bd_net [get_bd_pins v_tc_in/irq] [get_bd_pins V_TC_IN_IRQ]
connect_bd_net [get_bd_pins xlconcat_0/dout] [get_bd_pins switch_format_0/I_DATA]
connect_bd_net [get_bd_pins xlconstant_0/dout] [get_bd_pins rgb24_to_yuv444_full_0/I_USER]
connect_bd_net [get_bd_pins xlslice_0/Dout] [get_bd_pins xlconcat_0/In1] [get_bd_pins rgb24_to_yuv444_full_0/I_G]
connect_bd_net [get_bd_pins xlslice_1/Dout] [get_bd_pins xlconcat_0/In0] [get_bd_pins rgb24_to_yuv444_full_0/I_B]
connect_bd_net [get_bd_pins xlslice_2/Dout] [get_bd_pins xlconcat_0/In2] [get_bd_pins rgb24_to_yuv444_full_0/I_R]
connect_bd_net [get_bd_pins yuv411_add_dummy_pix_0/O_DATA] [get_bd_pins switch_format_0/F2I_DATA] [get_bd_pins system_ila_0/probe10]
connect_bd_net [get_bd_pins yuv411_add_dummy_pix_0/O_DE] [get_bd_pins switch_format_0/F2I_DE] [get_bd_pins system_ila_0/probe7]
connect_bd_net [get_bd_pins yuv444_to_yuv411_0/O_DE] [get_bd_pins system_ila_0/probe0] [get_bd_pins yuv411_add_dummy_pix_0/I_DE]
connect_bd_net [get_bd_pins yuv444_to_yuv411_0/O_HSYNC] [get_bd_pins system_ila_0/probe3] [get_bd_pins yuv411_add_dummy_pix_0/I_HSYNC]
connect_bd_net [get_bd_pins yuv444_to_yuv411_0/O_UV] [get_bd_pins system_ila_0/probe6] [get_bd_pins yuv411_add_dummy_pix_0/I_UV]
connect_bd_net [get_bd_pins yuv444_to_yuv411_0/O_VALID] [get_bd_pins system_ila_0/probe1] [get_bd_pins yuv411_add_dummy_pix_0/I_VALID]
connect_bd_net [get_bd_pins yuv444_to_yuv411_0/O_VSYNC] [get_bd_pins system_ila_0/probe2] [get_bd_pins yuv411_add_dummy_pix_0/I_VSYNC]
connect_bd_net [get_bd_pins yuv444_to_yuv411_0/O_Y0] [get_bd_pins system_ila_0/probe4] [get_bd_pins yuv411_add_dummy_pix_0/I_Y0]
connect_bd_net [get_bd_pins yuv444_to_yuv411_0/O_Y1] [get_bd_pins system_ila_0/probe5] [get_bd_pins yuv411_add_dummy_pix_0/I_Y1]

current_bd_instance /vcnet_io
connect_bd_intf_net [get_bd_intf_pins IR_CTRL] [get_bd_intf_pins axilite_regs_ir/s_axi_AXILiteS]
connect_bd_intf_net [get_bd_intf_pins M_AXI_WDT] [get_bd_intf_pins block_aximaster_0/interface_aximm]
connect_bd_intf_net [get_bd_intf_pins I2C_IR_CTRL] [get_bd_intf_pins axilite_regs_i2c_ir/s_axi_AXILiteS]
connect_bd_intf_net [get_bd_intf_pins SPI_CTRL] [get_bd_intf_pins axilite_regs_spi/s_axi_AXILiteS]
connect_bd_intf_net [get_bd_intf_pins reg_i2s_0/I] [get_bd_intf_pins axis_data_fifo_0/M_AXIS]
connect_bd_intf_net [get_bd_intf_pins axis_dwidth_converter_0/M_AXIS] [get_bd_intf_pins vcnet_ir_fmt_0/I]
connect_bd_intf_net [get_bd_intf_pins block_aximaster_0/RD] [get_bd_intf_pins ps_reboot_0/RD]
connect_bd_intf_net [get_bd_intf_pins axis_data_fifo_0/S_AXIS] [get_bd_intf_pins i2s_axis_0/S]
connect_bd_intf_net [get_bd_intf_pins ps_reboot_0/BLK] [get_bd_intf_pins block_aximaster_0/BLK]
connect_bd_intf_net [get_bd_intf_pins ps_reboot_0/WR] [get_bd_intf_pins block_aximaster_0/WR]
connect_bd_intf_net -intf_net regs_maxis_0_O [get_bd_intf_pins axis_dwidth_converter_0/S_AXIS] [get_bd_intf_pins axis_data_fifo_1/M_AXIS]
connect_bd_intf_net [get_bd_intf_pins axis_dwidth_converter_0/S_AXIS] [get_bd_intf_pins system_ila_0/SLOT_0_AXIS]
connect_bd_intf_net [get_bd_intf_pins regs_maxis_0/O] [get_bd_intf_pins axis_data_fifo_1/S_AXIS]
connect_bd_intf_net [get_bd_intf_pins vcnet_ir_fmt_0/O] [get_bd_intf_pins vcnet_ir_control_0/I]
connect_bd_intf_net [get_bd_intf_pins vcnet_ir_fmt_0/O] [get_bd_intf_pins system_ila_0/SLOT_1_AXIS]
connect_bd_net [get_bd_pins CLK0] \
  [get_bd_pins axilite_regs_i2c_ir/CLK] [get_bd_pins axilite_regs_spi/CLK] [get_bd_pins ps_watchdog_0/CLK] \
  [get_bd_pins ps_reboot_0/CLK] [get_bd_pins block_aximaster_0/CLK] [get_bd_pins i2s_axis_0/CLK] \
  [get_bd_pins axis_data_fifo_0/s_axis_aclk] [get_bd_pins reg_i2s_0/CLK] [get_bd_pins vcnet_reg_array_0/CLK] \
  [get_bd_pins vcnet_spi_peripheral_0/CLK] [get_bd_pins axilite_regs_ir/CLK] [get_bd_pins vcnet_ir_control_0/CLK] \
  [get_bd_pins axis_dwidth_converter_0/aclk] [get_bd_pins system_ila_0/clk] [get_bd_pins regs_i2c_master_0/CLK] \
  [get_bd_pins axis_data_fifo_1/s_axis_aclk] [get_bd_pins regs_maxis_0/CLK] [get_bd_pins vcnet_ir_fmt_0/CLK]
connect_bd_net -net I2S_BCLK_0_1 [get_bd_pins I2S_BCLK] [get_bd_pins i2s_axis_0/I2S_BCLK]
connect_bd_net -net I2S_DAT_0_1 [get_bd_pins I2S_DAT] [get_bd_pins i2s_axis_0/I2S_DAT]
connect_bd_net -net I2S_LR_0_1 [get_bd_pins I2S_LR] [get_bd_pins i2s_axis_0/I2S_LR]
connect_bd_net -net RESETN_1 [get_bd_pins CLK0_RESETN] \
  [get_bd_pins axilite_regs_i2c_ir/RESETN] [get_bd_pins axilite_regs_spi/RESETN] [get_bd_pins ps_watchdog_0/RESETN] \
  [get_bd_pins ps_reboot_0/RESETN] [get_bd_pins block_aximaster_0/RESET_N] [get_bd_pins i2s_axis_0/RESETN] \
  [get_bd_pins axis_data_fifo_0/s_axis_aresetn] [get_bd_pins reg_i2s_0/RESETN] [get_bd_pins vcnet_reg_array_0/RESETN] \
  [get_bd_pins vcnet_spi_peripheral_0/RESETN] [get_bd_pins axilite_regs_ir/RESETN] [get_bd_pins vcnet_ir_control_0/RESETN] \
  [get_bd_pins axis_dwidth_converter_0/aresetn] [get_bd_pins system_ila_0/resetn] [get_bd_pins regs_i2c_master_0/RESETN] \
  [get_bd_pins axis_data_fifo_1/s_axis_aresetn] [get_bd_pins regs_maxis_0/RESETN] [get_bd_pins vcnet_ir_fmt_0/RESETN]
connect_bd_net -net SCLK_0_1 [get_bd_pins EXT_MCU_SCLK] [get_bd_pins vcnet_spi_peripheral_0/SCLK]
connect_bd_net [get_bd_pins axilite_regs_i2c_ir/RD_ADDR] [get_bd_pins regs_i2c_master_0/RD_ADDR]
connect_bd_net [get_bd_pins axilite_regs_i2c_ir/RD_ADDR_EN] [get_bd_pins regs_i2c_master_0/RD_ADDR_EN]
connect_bd_net [get_bd_pins axilite_regs_i2c_ir/WR_ADDR] [get_bd_pins regs_i2c_master_0/WR_ADDR]
connect_bd_net [get_bd_pins axilite_regs_i2c_ir/WR_DATA] [get_bd_pins regs_i2c_master_0/WR_DATA]
connect_bd_net [get_bd_pins axilite_regs_i2c_ir/WR_EN] [get_bd_pins regs_i2c_master_0/WR_EN]
connect_bd_net [get_bd_pins axilite_regs_ir/RD_ADDR] [get_bd_pins system_ila_0/probe6] [get_bd_pins regs_maxis_0/RD_ADDR]
connect_bd_net [get_bd_pins axilite_regs_ir/RD_ADDR_EN] [get_bd_pins system_ila_0/probe5] [get_bd_pins regs_maxis_0/RD_ADDR_EN]
connect_bd_net [get_bd_pins axilite_regs_ir/WR_ADDR] [get_bd_pins system_ila_0/probe3] [get_bd_pins regs_maxis_0/WR_ADDR]
connect_bd_net [get_bd_pins axilite_regs_ir/WR_DATA] [get_bd_pins system_ila_0/probe4] [get_bd_pins regs_maxis_0/WR_DATA]
connect_bd_net [get_bd_pins axilite_regs_ir/WR_EN] [get_bd_pins system_ila_0/probe2] [get_bd_pins regs_maxis_0/WR_EN]
connect_bd_net [get_bd_pins axilite_regs_spi/WR_ADDR] [get_bd_pins vcnet_reg_array_0/WR_IDX]
connect_bd_net [get_bd_pins axilite_regs_spi/WR_DATA] [get_bd_pins vcnet_reg_array_0/WR_VALUE]
connect_bd_net [get_bd_pins axilite_regs_spi/WR_EN] [get_bd_pins vcnet_reg_array_0/WR_ENABLE]
connect_bd_net [get_bd_pins ps_reboot_0/BLK_ADDRESS] [get_bd_pins block_aximaster_0/BLK_ADDRESS]
connect_bd_net [get_bd_pins ps_reboot_0/BLK_MODE_WRITE] [get_bd_pins block_aximaster_0/BLK_MODE_WRITE]
connect_bd_net [get_bd_pins ps_reboot_0/REP_COUNT] [get_bd_pins block_aximaster_0/BLK_COUNT_M1]
connect_bd_net [get_bd_pins ps_watchdog_0/PS_REBOOT_EN] [get_bd_pins ps_reboot_0/PS_REBOOT_EN]
connect_bd_net [get_bd_pins reg_i2s_0/ODATA] [get_bd_pins regs_i2c_master_0/I2S_DATA]
connect_bd_net [get_bd_pins regs_i2c_master_0/GPIO_OUT] [get_bd_pins GPIO_OUT]
connect_bd_net [get_bd_pins regs_i2c_master_0/I2S_PULL_DATA] [get_bd_pins reg_i2s_0/PULL_ODATA]
connect_bd_net [get_bd_pins regs_i2c_master_0/IR_OUT] [get_bd_pins util_vector_logic_0/Op1]
connect_bd_net [get_bd_pins regs_i2c_master_0/LED] [get_bd_pins LED] [get_bd_pins ps_watchdog_0/HEARTBEAT_VALUE]
connect_bd_net [get_bd_pins regs_i2c_master_0/RD_DATA] [get_bd_pins axilite_regs_i2c_ir/RD_DATA]
connect_bd_net [get_bd_pins regs_i2c_master_0/RD_DATA_EN] [get_bd_pins axilite_regs_i2c_ir/RD_DATA_EN]
connect_bd_net [get_bd_pins regs_i2c_master_0/WATCHDOG] [get_bd_pins ps_watchdog_0/WATCHDOG_SEC]
connect_bd_net [get_bd_pins regs_maxis_0/RD_DATA] [get_bd_pins axilite_regs_ir/RD_DATA] [get_bd_pins system_ila_0/probe8]
connect_bd_net [get_bd_pins regs_maxis_0/RD_DATA_EN] [get_bd_pins axilite_regs_ir/RD_DATA_EN] [get_bd_pins system_ila_0/probe7]
connect_bd_net [get_bd_pins val0_32/dout] [get_bd_pins axilite_regs_spi/RD_DATA] [get_bd_pins regs_i2c_master_0/I2C_RDATA]
connect_bd_net [get_bd_pins val0_3/dout] [get_bd_pins regs_i2c_master_0/I2C_ERROR]
connect_bd_net [get_bd_pins val0/dout] [get_bd_pins axilite_regs_spi/RD_DATA_EN] [get_bd_pins regs_i2c_master_0/I2C_READY]
connect_bd_net [get_bd_pins vcnet_ir_control_0/DBG_STATE] [get_bd_pins system_ila_0/probe0]
connect_bd_net -net vcnet_ir_control_0_IR_OUT [get_bd_pins util_vector_logic_0/Res] [get_bd_pins IR_OUT] [get_bd_pins system_ila_0/probe1]
connect_bd_net [get_bd_pins vcnet_ir_control_0/IR_OUT] [get_bd_pins util_vector_logic_0/Op2]
connect_bd_net [get_bd_pins vcnet_reg_array_0/VAL_ARRAY] [get_bd_pins vcnet_spi_peripheral_0/VAL_ARRAY]
connect_bd_net [get_bd_pins vcnet_spi_peripheral_0/DOUT] [get_bd_pins EXT_MCU_DOUT]

current_bd_instance /zynq
connect_bd_intf_net [get_bd_intf_pins FIXED_IO] [get_bd_intf_pins processing_system7_0/FIXED_IO]
connect_bd_intf_net [get_bd_intf_pins DDR] [get_bd_intf_pins processing_system7_0/DDR]
connect_bd_intf_net [get_bd_intf_pins S_AXI_HP0] [get_bd_intf_pins processing_system7_0/S_AXI_HP0]
connect_bd_intf_net [get_bd_intf_pins M_AXI_GP0] [get_bd_intf_pins processing_system7_0/M_AXI_GP0]
connect_bd_intf_net [get_bd_intf_pins S_AXI_GP0] [get_bd_intf_pins processing_system7_0/S_AXI_GP0]
connect_bd_net [get_bd_pins IRQ_F2P] [get_bd_pins processing_system7_0/IRQ_F2P]
connect_bd_net [get_bd_pins processing_system7_0/FCLK_CLK0] \
  [get_bd_pins FCLK_CLK0] [get_bd_pins processing_system7_0/M_AXI_GP0_ACLK] [get_bd_pins processing_system7_0/S_AXI_GP0_ACLK] \
  [get_bd_pins rst_ps7_clk0_100M/slowest_sync_clk]
connect_bd_net [get_bd_pins processing_system7_0/FCLK_CLK1] \
  [get_bd_pins FCLK_CLK1] [get_bd_pins processing_system7_0/S_AXI_HP0_ACLK] [get_bd_pins rst_ps7_clk1_142M/slowest_sync_clk]
connect_bd_net [get_bd_pins processing_system7_0/FCLK_CLK2] [get_bd_pins FCLK_CLK2]
connect_bd_net [get_bd_pins processing_system7_0/FCLK_RESET0_N] \
  [get_bd_pins FCLK_RESET0_N] [get_bd_pins rst_ps7_clk1_142M/ext_reset_in] [get_bd_pins rst_ps7_clk0_100M/ext_reset_in]
connect_bd_net [get_bd_pins rst_ps7_clk0_100M/interconnect_aresetn] [get_bd_pins CLK0_interconnect_aresetn1]
connect_bd_net [get_bd_pins rst_ps7_clk0_100M/peripheral_aresetn] [get_bd_pins CLK0_peripheral_aresetn1]
connect_bd_net [get_bd_pins rst_ps7_clk1_142M/interconnect_aresetn] [get_bd_pins CLK1_interconnect_aresetn]
connect_bd_net [get_bd_pins rst_ps7_clk1_142M/peripheral_aresetn] [get_bd_pins CLK1_peripheral_aresetn]

current_bd_instance /
connect_bd_intf_net [get_bd_intf_pins vcnet_io/M_AXI_WDT] [get_bd_intf_pins s_axi_gp0/S00_AXI]
connect_bd_intf_net [get_bd_intf_pins m_axi_periph/S00_AXI] [get_bd_intf_pins zynq/M_AXI_GP0]
connect_bd_intf_net [get_bd_intf_ports TMDS_IN] [get_bd_intf_pins hdmi_in/TMDS]
connect_bd_intf_net -intf_net axi_mem_intercon_1_M00_AXI [get_bd_intf_pins s_axi_gp0/M00_AXI] [get_bd_intf_pins zynq/S_AXI_GP0]
connect_bd_intf_net -intf_net axi_mem_intercon_M00_AXI [get_bd_intf_pins s_axi_hp0/M00_AXI] [get_bd_intf_pins zynq/S_AXI_HP0]
connect_bd_intf_net [get_bd_intf_pins axi_vdma_0/M_AXIS_MM2S] [get_bd_intf_pins hdmi_out/video_in]
connect_bd_intf_net [get_bd_intf_pins axi_vdma_0/M_AXI_MM2S] [get_bd_intf_pins s_axi_hp0/S01_AXI]
connect_bd_intf_net [get_bd_intf_pins axi_vdma_0/M_AXI_S2MM] [get_bd_intf_pins s_axi_hp0/S00_AXI]
connect_bd_intf_net [get_bd_intf_ports DDC] [get_bd_intf_pins hdmi_in/DDC]
connect_bd_intf_net -intf_net hdmi_in_M0 [get_bd_intf_pins axi_vdma_0/S_AXIS_S2MM] [get_bd_intf_pins hdmi_in/VIN_VIDEO_OUT]
connect_bd_intf_net [get_bd_intf_ports HDMI_HPD] [get_bd_intf_pins hdmi_in/HDMI_HPD]
connect_bd_intf_net [get_bd_intf_ports TMDS_OUT] [get_bd_intf_pins hdmi_out/TMDS_1]
connect_bd_intf_net [get_bd_intf_pins m_axi_periph/M01_AXI] [get_bd_intf_pins hdmi_in/HDMI_IN_GPIO]
connect_bd_intf_net [get_bd_intf_pins m_axi_periph/M08_AXI] [get_bd_intf_pins vcnet_io/IR_CTRL]
connect_bd_intf_net [get_bd_intf_pins m_axi_periph/M09_AXI] [get_bd_intf_pins hdmi_in/HDMI_IN_STAT]
connect_bd_intf_net [get_bd_intf_pins hdmi_out/s00_axi] [get_bd_intf_pins m_axi_periph/M00_AXI]
connect_bd_intf_net [get_bd_intf_pins axi_vdma_0/S_AXI_LITE] [get_bd_intf_pins m_axi_periph/M02_AXI]
connect_bd_intf_net [get_bd_intf_pins hdmi_out/V_TC_OUT_CTRL] [get_bd_intf_pins m_axi_periph/M03_AXI]
connect_bd_intf_net [get_bd_intf_pins hdmi_in/V_TC_IN_CTRL] [get_bd_intf_pins m_axi_periph/M04_AXI]
connect_bd_intf_net [get_bd_intf_pins vcnet_get_dma_addr/s_axi_AXILiteS] [get_bd_intf_pins m_axi_periph/M05_AXI]
connect_bd_intf_net [get_bd_intf_pins vcnet_io/SPI_CTRL] [get_bd_intf_pins m_axi_periph/M06_AXI]
connect_bd_intf_net [get_bd_intf_pins vcnet_io/I2C_IR_CTRL] [get_bd_intf_pins m_axi_periph/M07_AXI]
connect_bd_intf_net [get_bd_intf_ports DDR] [get_bd_intf_pins zynq/DDR]
connect_bd_intf_net [get_bd_intf_ports FIXED_IO] [get_bd_intf_pins zynq/FIXED_IO]
connect_bd_net -net ARESETN_1 [get_bd_pins zynq/CLK1_interconnect_aresetn] [get_bd_pins s_axi_hp0/ARESETN]
connect_bd_net -net ARESETN_2 [get_bd_pins zynq/CLK0_interconnect_aresetn1] [get_bd_pins m_axi_periph/ARESETN] [get_bd_pins s_axi_gp0/ARESETN]
connect_bd_net -net CLK2_1 [get_bd_pins zynq/FCLK_CLK2] [get_bd_pins hdmi_in/CLK2]
connect_bd_net -net I2S_BCLK_0_1 [get_bd_ports I2S_BCLK] [get_bd_pins vcnet_io/I2S_BCLK]
connect_bd_net -net I2S_DAT_0_1 [get_bd_ports I2S_DAT] [get_bd_pins vcnet_io/I2S_DAT]
connect_bd_net -net I2S_LR_0_1 [get_bd_ports I2S_LR] [get_bd_pins vcnet_io/I2S_LR]
connect_bd_net -net PROC_RESETN_1 [get_bd_pins zynq/FCLK_RESET0_N] [get_bd_pins hdmi_in/PROC_RESETN]
connect_bd_net -net S00_AXI_awvalid_1 [get_bd_pins axi_vdma_0/m_axi_s2mm_awvalid] \
  [get_bd_pins vcnet_get_dma_addr/AXI_AWVALID] [get_bd_pins s_axi_hp0/S00_AXI_awvalid]
connect_bd_net -net SCLK_0_1 [get_bd_ports EXT_MCU_SCLK] [get_bd_pins vcnet_io/EXT_MCU_SCLK]
connect_bd_net -net axi_mem_intercon_S00_AXI_awready [get_bd_pins s_axi_hp0/S00_AXI_awready] \
  [get_bd_pins axi_vdma_0/m_axi_s2mm_awready] [get_bd_pins vcnet_get_dma_addr/AXI_AWREADY]
connect_bd_net [get_bd_pins axi_vdma_0/m_axi_s2mm_awaddr] [get_bd_pins vcnet_get_dma_addr/AXI_AWADDR] [get_bd_pins s_axi_hp0/S00_AXI_awaddr]
connect_bd_net [get_bd_pins axi_vdma_0/mm2s_introut] [get_bd_pins xlconcat_0/In1]
connect_bd_net [get_bd_pins axi_vdma_0/s2mm_introut] [get_bd_pins xlconcat_0/In0]
connect_bd_net [get_bd_pins hdmi_in/ip2intc_irpt] [get_bd_pins xlconcat_0/In4]
connect_bd_net -net hdmi_in_irq [get_bd_pins hdmi_in/V_TC_IN_IRQ] [get_bd_pins xlconcat_0/In3]
connect_bd_net -net hdmi_out_irq [get_bd_pins hdmi_out/V_TC_OUT_IRQ] [get_bd_pins xlconcat_0/In2]
connect_bd_net -net processing_system7_0_FCLK_CLK0 [get_bd_pins zynq/FCLK_CLK0] \
  [get_bd_pins axi_vdma_0/s_axi_lite_aclk] [get_bd_pins hdmi_out/CLK0] [get_bd_pins hdmi_in/CLK0] [get_bd_pins vcnet_io/CLK0] \
  [get_bd_pins m_axi_periph/ACLK] [get_bd_pins m_axi_periph/S00_ACLK] [get_bd_pins m_axi_periph/M00_ACLK] \
  [get_bd_pins m_axi_periph/M01_ACLK] [get_bd_pins m_axi_periph/M02_ACLK] [get_bd_pins m_axi_periph/M03_ACLK] \
  [get_bd_pins m_axi_periph/M04_ACLK] [get_bd_pins s_axi_gp0/S00_ACLK] [get_bd_pins s_axi_gp0/M00_ACLK] \
  [get_bd_pins s_axi_gp0/ACLK] [get_bd_pins m_axi_periph/M06_ACLK] [get_bd_pins m_axi_periph/M07_ACLK] \
  [get_bd_pins m_axi_periph/M08_ACLK] [get_bd_pins m_axi_periph/M09_ACLK]
connect_bd_net -net processing_system7_0_FCLK_CLK1 [get_bd_pins zynq/FCLK_CLK1] \
  [get_bd_pins axi_vdma_0/m_axi_mm2s_aclk] [get_bd_pins axi_vdma_0/m_axis_mm2s_aclk] [get_bd_pins axi_vdma_0/m_axi_s2mm_aclk] \
  [get_bd_pins axi_vdma_0/s_axis_s2mm_aclk] [get_bd_pins vcnet_get_dma_addr/CLK1] [get_bd_pins hdmi_out/CLK1] \
  [get_bd_pins hdmi_in/CLK1] [get_bd_pins s_axi_hp0/ACLK] [get_bd_pins s_axi_hp0/S00_ACLK] [get_bd_pins s_axi_hp0/M00_ACLK] \
  [get_bd_pins s_axi_hp0/S01_ACLK] [get_bd_pins m_axi_periph/M05_ACLK]
connect_bd_net -net rst_ps7_0_100M_peripheral_aresetn [get_bd_pins zynq/CLK0_peripheral_aresetn1] \
  [get_bd_pins axi_vdma_0/axi_resetn] [get_bd_pins hdmi_out/CLK0_RESETN] [get_bd_pins hdmi_in/CLK0_RESETN] \
  [get_bd_pins vcnet_io/CLK0_RESETN] [get_bd_pins m_axi_periph/S00_ARESETN] [get_bd_pins m_axi_periph/M00_ARESETN] \
  [get_bd_pins m_axi_periph/M01_ARESETN] [get_bd_pins m_axi_periph/M02_ARESETN] [get_bd_pins m_axi_periph/M03_ARESETN] \
  [get_bd_pins m_axi_periph/M04_ARESETN] [get_bd_pins s_axi_gp0/S00_ARESETN] [get_bd_pins s_axi_gp0/M00_ARESETN] \
  [get_bd_pins m_axi_periph/M06_ARESETN] [get_bd_pins m_axi_periph/M07_ARESETN] [get_bd_pins m_axi_periph/M08_ARESETN] \
  [get_bd_pins m_axi_periph/M09_ARESETN]
connect_bd_net -net rst_ps7_0_142M_peripheral_aresetn [get_bd_pins zynq/CLK1_peripheral_aresetn] \
  [get_bd_pins vcnet_get_dma_addr/CKL1_RESETN] [get_bd_pins hdmi_in/CLK1_RESETN] [get_bd_pins s_axi_hp0/S00_ARESETN] \
  [get_bd_pins s_axi_hp0/M00_ARESETN] [get_bd_pins s_axi_hp0/S01_ARESETN] [get_bd_pins m_axi_periph/M05_ARESETN]
connect_bd_net -net vcnet_get_dma_addr_Dout [get_bd_pins vcnet_get_dma_addr/FORMAT] [get_bd_pins hdmi_in/FORMAT]
connect_bd_net -net vcnet_io_DOUT_0 [get_bd_pins vcnet_io/EXT_MCU_DOUT] [get_bd_ports EXT_MCU_DOUT]
connect_bd_net [get_bd_pins vcnet_io/GPIO_OUT] [get_bd_ports GPIO_OUT]
connect_bd_net [get_bd_pins vcnet_io/IR_OUT] [get_bd_ports IR_OUT]
connect_bd_net [get_bd_pins vcnet_io/LED] [get_bd_ports LED]
connect_bd_net [get_bd_pins xlconcat_0/dout] [get_bd_pins zynq/IRQ_F2P]

# ---- address map ----
assign_bd_address -offset 0x00000000 -range 512M -target_address_space [get_bd_addr_spaces axi_vdma_0/Data_MM2S] [get_bd_addr_segs zynq/processing_system7_0/S_AXI_HP0/HP0_DDR_LOWOCM]
assign_bd_address -offset 0x00000000 -range 512M -target_address_space [get_bd_addr_spaces axi_vdma_0/Data_S2MM] [get_bd_addr_segs zynq/processing_system7_0/S_AXI_HP0/HP0_DDR_LOWOCM]
assign_bd_address -offset 0x00000000 -range 512M -target_address_space [get_bd_addr_spaces vcnet_io/block_aximaster_0/interface_aximm] [get_bd_addr_segs zynq/processing_system7_0/S_AXI_GP0/GP0_DDR_LOWOCM]
assign_bd_address -offset 0x40000000 -range 1G -target_address_space [get_bd_addr_spaces vcnet_io/block_aximaster_0/interface_aximm] [get_bd_addr_segs zynq/processing_system7_0/S_AXI_GP0/GP0_M_AXI_GP0]
assign_bd_address -offset 0xE0000000 -range 4M -target_address_space [get_bd_addr_spaces vcnet_io/block_aximaster_0/interface_aximm] [get_bd_addr_segs zynq/processing_system7_0/S_AXI_GP0/GP0_IOP]
assign_bd_address -offset 0xFC000000 -range 16M -target_address_space [get_bd_addr_spaces vcnet_io/block_aximaster_0/interface_aximm] [get_bd_addr_segs zynq/processing_system7_0/S_AXI_GP0/GP0_QSPI_LINEAR]
assign_bd_address -offset 0x41200000 -range 64K -target_address_space [get_bd_addr_spaces zynq/processing_system7_0/Data] [get_bd_addr_segs hdmi_in/axi_gpio_video/S_AXI/Reg]
assign_bd_address -offset 0x43000000 -range 64K -target_address_space [get_bd_addr_spaces zynq/processing_system7_0/Data] [get_bd_addr_segs axi_vdma_0/S_AXI_LITE/Reg]
assign_bd_address -offset 0x43C00000 -range 64K -target_address_space [get_bd_addr_spaces zynq/processing_system7_0/Data] [get_bd_addr_segs hdmi_out/axi_dynclk_0/s00_axi/reg0]
assign_bd_address -offset 0x43C10000 -range 64K -target_address_space [get_bd_addr_spaces zynq/processing_system7_0/Data] [get_bd_addr_segs hdmi_out/v_tc_out/ctrl/Reg]
assign_bd_address -offset 0x43C20000 -range 64K -target_address_space [get_bd_addr_spaces zynq/processing_system7_0/Data] [get_bd_addr_segs hdmi_in/v_tc_in/ctrl/Reg]
assign_bd_address -offset 0x43C30000 -range 64K -target_address_space [get_bd_addr_spaces zynq/processing_system7_0/Data] [get_bd_addr_segs vcnet_get_dma_addr/axilite_regs_0/s_axi_AXILiteS/reg0]
assign_bd_address -offset 0x43C40000 -range 64K -target_address_space [get_bd_addr_spaces zynq/processing_system7_0/Data] [get_bd_addr_segs vcnet_io/axilite_regs_i2c_ir/s_axi_AXILiteS/reg0]
assign_bd_address -offset 0x43C50000 -range 64K -target_address_space [get_bd_addr_spaces zynq/processing_system7_0/Data] [get_bd_addr_segs vcnet_io/axilite_regs_spi/s_axi_AXILiteS/reg0]
assign_bd_address -offset 0x43C60000 -range 64K -target_address_space [get_bd_addr_spaces zynq/processing_system7_0/Data] [get_bd_addr_segs vcnet_io/axilite_regs_ir/s_axi_AXILiteS/reg0]
assign_bd_address -offset 0x43C70000 -range 64K -target_address_space [get_bd_addr_spaces zynq/processing_system7_0/Data] [get_bd_addr_segs hdmi_in/axilite_regs_hdmi_in_stat/s_axi_AXILiteS/reg0]

validate_bd_design
save_bd_design
